# Altium schematic sheet sch_Power.SchDoc
size A4
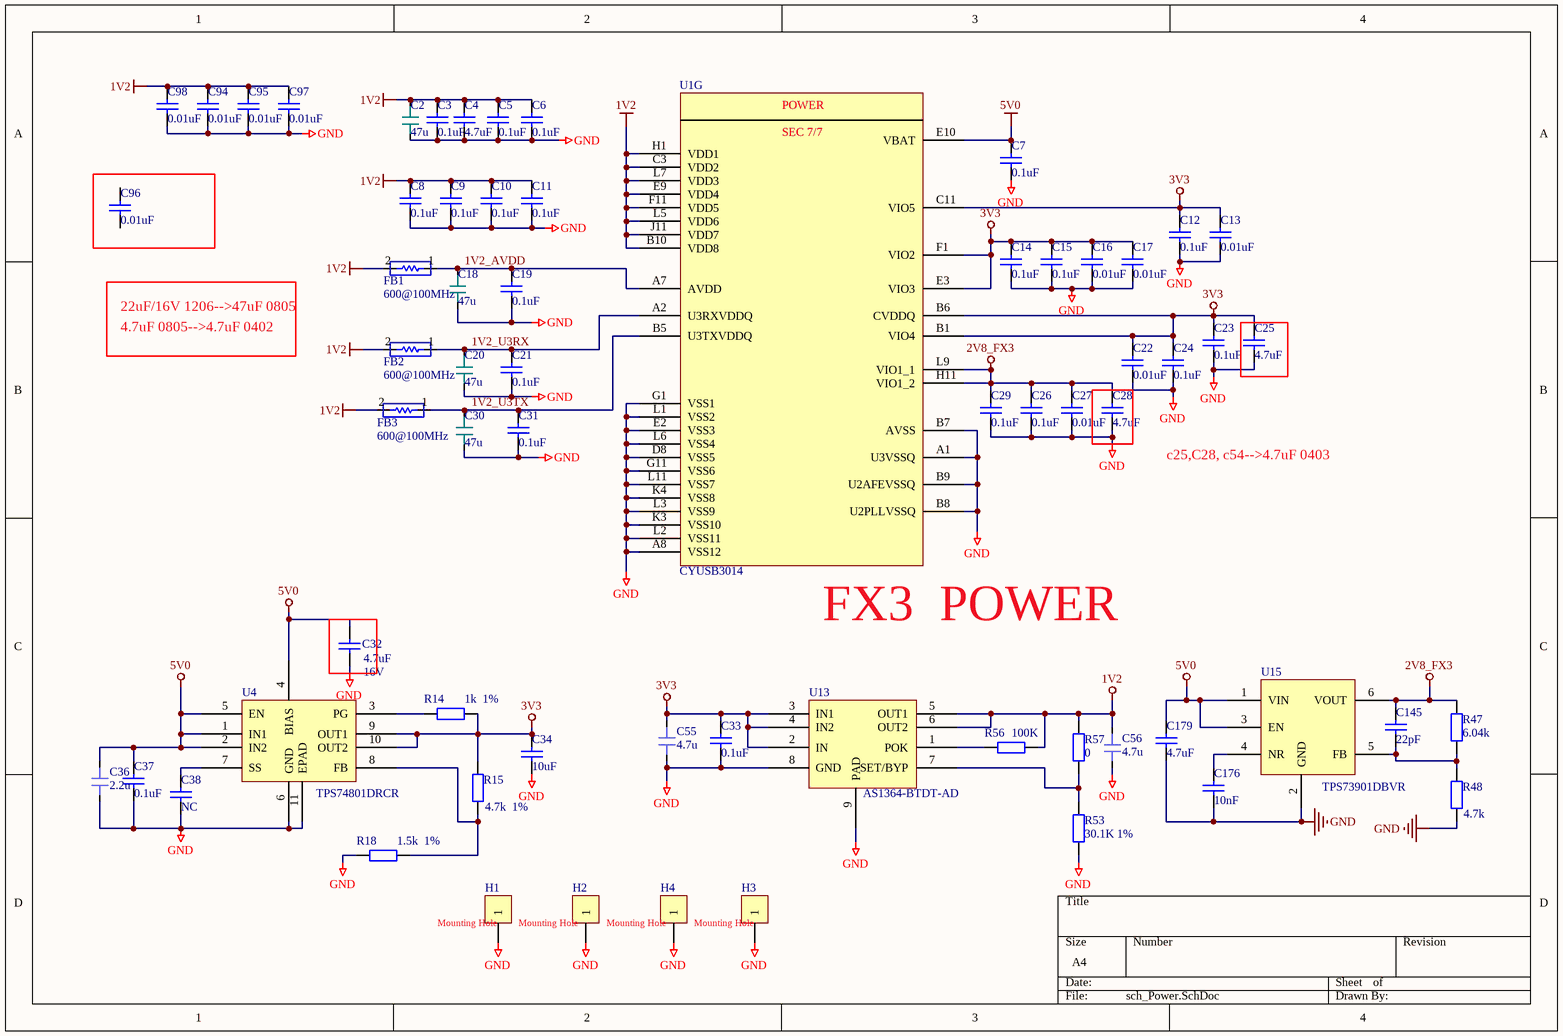
[diagram p0: sch_Power.SchDoc]

## Parts
C2  47u  [0805C]
C3  0.1uF  [0402C]
C4  value 4.7uF  [0402C]  (hidden comment: 0.1uF)
C5  0.1uF  [0402C]
C6  0.1uF  [0402C]
C7  0.1uF  [0402C]
C8  0.1uF  [0402C]
C9  0.1uF  [0402C]
C10  0.1uF  [0402C]
C11  0.1uF  [0402C]
C12  0.1uF  [0402C]
C13  0.01uF  [0402C]
C14  0.1uF  [0402C]
C15  0.1uF  [0402C]
C16  0.01uF  [0402C]
C17  0.01uF  [0402C]
C18  47u  [0805C]
C19  0.1uF  [0402C]
C20  47u  [0805C]
C21  0.1uF  [0402C]
C22  0.01uF  [0402C]
C23  0.1uF  [0402C]
C24  0.1uF  [0402C]
C25  4.7uF  [0402C]
C26  0.1uF  [0402C]
C27  0.01uF  [0402C]
C28  4.7uF  [0402C]
C29  0.1uF  [0402C]
C30  47u  [0805C]
C31  0.1uF  [0402C]
C32  4.7uF  value 16V  [0402C]
C33  0.1uF  [0402C]
C34  10uF  [0805C]
C36  2.2u  [0402C]
C37  0.1uF  [0402C]
C38  NC  [0402C]
C55  4.7u  [0402C]
C56  4.7u  [0402C]
C94  0.01uF  [0402C]
C95  0.01uF  [0402C]
C96  0.01uF  [0402C]
C97  0.01uF  [0402C]
C98  0.01uF  [0402C]
C145  22pF  [0805C]
C176  10nF  [0402C_L]
C179  4.7uF  [0402C_L]
FB1  600@100MHz  [0603R]
FB2  600@100MHz  [0603R]
FB3  600@100MHz  [0603R]
H1  CON1  [PAD_M3_D350_450]  (value not drawn)
H2  CON1  [PAD_M3_D350_450]  (value not drawn)
H3  CON1  [PAD_M3_D350_450]  (value not drawn)
H4  CON1  [PAD_M3_D350_450]  (value not drawn)
R14  value 1k  1%  [0402R]  (hidden comment: 1K)
R15  value 4.7k  1%  [0402R]  (hidden comment: 4.7K)
R18  value 1.5k  1%  [0402R]  (hidden comment: 1.5K)
R47  6.04K  [0402R]
R48  4.7K  [0402R]
R53  value 30.1K 1%  [0402R]  (hidden comment: 30.1K)
R56  100K  [0402R]
R57  value 0  [0402R]  (hidden comment: 0R)
U1  CYUSB3014  [FBGA121_P80L100W100H11]  (part G of 7)
U4  TPS74801DRCR  [SON10_P50L32W32H10_DRC]
U13  AS1364-BTDT-AD  [TDFN8_P65L30W30H08]
U15  TPS73901DBVR

## Nets
1V2: C2.1 C3.2 C4.2 C5.2 C6.2 C8.2 C9.2 C10.2 C11.2 C56.1 C94.2 C95.2 C97.2 C98.2 FB1.2 FB2.2 FB3.2 R56.1 R57.1 U1.B10(VDD8) U1.C3(VDD2) U1.E9(VDD4) U1.F11(VDD5) U1.H1(VDD1) U1.J11(VDD7) U1.L5(VDD6) U1.L7(VDD3) U13.5(OUT1) U13.6(OUT2)
2V8_FX3: C26.2 C27.2 C28.2 C29.2 C145.2 R47.2 U1.H11(VIO1_2) U1.L9(VIO1_1) U15.6(VOUT)
3V3: C12.2 C13.2 C14.2 C15.2 C16.2 C17.2 C22.2 C23.2 C24.2 C25.2 C33.2 C34.2 C55.1 R14.1 R15.1 U1.B1(VIO4) U1.B6(CVDDQ) U1.C11(VIO5) U1.E3(VIO3) U1.F1(VIO2) U4.9(OUT1) U4.10(OUT2) U13.2(IN) U13.3(IN1) U13.4(IN2)
5V0: C7.2 C32.1 C36.1 C37.2 C179.2 U1.E10(VBAT) U4.1(IN1) U4.2(IN2) U4.4(BIAS) U4.5(EN) U15.1(VIN) U15.3(EN)
GND: C2.2 C3.1 C4.1 C5.1 C6.1 C7.1 C8.1 C9.1 C10.1 C11.1 C12.1 C13.1 C14.1 C15.1 C16.1 C17.1 C18.2 C19.1 C20.2 C21.1 C22.1 C23.1 C24.1 C25.1 C26.1 C27.1 C28.1 C29.1 C30.2 C31.1 C32.2 C33.1 C34.1 C36.2 C37.1 C38.1 C55.2 C56.2 C94.1 C95.1 C97.1 C98.1 C176.1 C179.1 H1.1 H2.1 H3.1 H4.1 R18.2 R48.2 R53.2 U1.A1(U3VSSQ) U1.A8(VSS12) U1.B7(AVSS) U1.B8(U2PLLVSSQ) U1.B9(U2AFEVSSQ) U1.D8(VSS5) U1.E2(VSS3) U1.G1(VSS1) U1.G11(VSS6) U1.K3(VSS10) U1.K4(VSS8) U1.L1(VSS2) U1.L2(VSS11) U1.L3(VSS9) U1.L6(VSS4) U1.L11(VSS7) U4.6(GND) U4.11(EPAD) U13.8(GND) U13.9(PAD) U15.2(GND)
1V2_AVDD: C18.1 C19.2 FB1.1 U1.A7(AVDD)
1V2_U3RX: C20.1 C21.2 FB2.1 U1.A2(U3RXVDDQ)
1V2_U3TX: C30.1 C31.2 FB3.1 U1.B5(U3TXVDDQ)
NetC38_2: C38.2 U4.7(SS)
NetC145_1: C145.1 R47.1 R48.1 U15.5(FB)
NetC176_2: C176.2 U15.4(NR)
NetR14_2: R14.2 U4.3(PG)
NetR15_2: R15.2 R18.1 U4.8(FB)
NetR53_1: R53.1 R57.2 U13.7(SET/BYP)
NetR56_2: R56.2 U13.1(POK)

Not connected (* = marked no-connect by the designer): C96 1 2

## Notes on the sheet
- 22uF/16V 1206-->47uF 0805
- 4.7uF 0805-->4.7uF 0402
- c25,C28, c54-->4.7uF 0403
- (near U1) FX3  POWER
- (near H1) Mounting Hole
- (near H2) Mounting Hole
- (near H4) Mounting Hole
- (near H3) Mounting Hole
- (in symbol CYUSB3014, part G) POWER; SEC 7/7

## Library data of the parts
C2 C18 C20 C30 = cap0805: CC08052B476M5B20D; 元件类别: 贴片电容; 主物料厂家: YAGEO
C3-C17 C19 C21-C29 C31-C34 C37 C38 C94-C98 C145 C176 C179 = Cap: Capacitor; Published: 8-Jun-2000; LatestRevisionDate: 17-Jul-2002; LatestRevisionNote: Re-released for DXP Platform.; PackageReference: RAD-0.3; Publisher: Altium Limited
  C3 C5-C12 C14 C15 C19 C21 C23 C24 C26 C29 C31 C33 C37: Value: 0.1uF
  C13 C16 C17 C22 C27 C94-C98: Value: 0.01uF
  C25 C28 C179: Value: 4.7uF
  C34: Value: 10uF
  C38: Value: NC
  C145: Value: 22pF
  C176: Value: 10nF
C36 C55 C56 = cap0402: CC0402MRX5R5BB475; 元件类别: 贴片电容; 主物料厂家: YAGEO
H1-H4 = CON1: Connector
R14 R15 R18 R47 R48 R53 R56 R57 = Resistor: Published: 8-Jun-2000; LatestRevisionDate: 17-Jul-2002; LatestRevisionNote: Re-released for DXP Platform.; PackageReference: AXIAL-0.4; Publisher: Altium Limited
  R47: Value: 6.04k
  R48: Value: 4.7k
  R56: Value: 100K